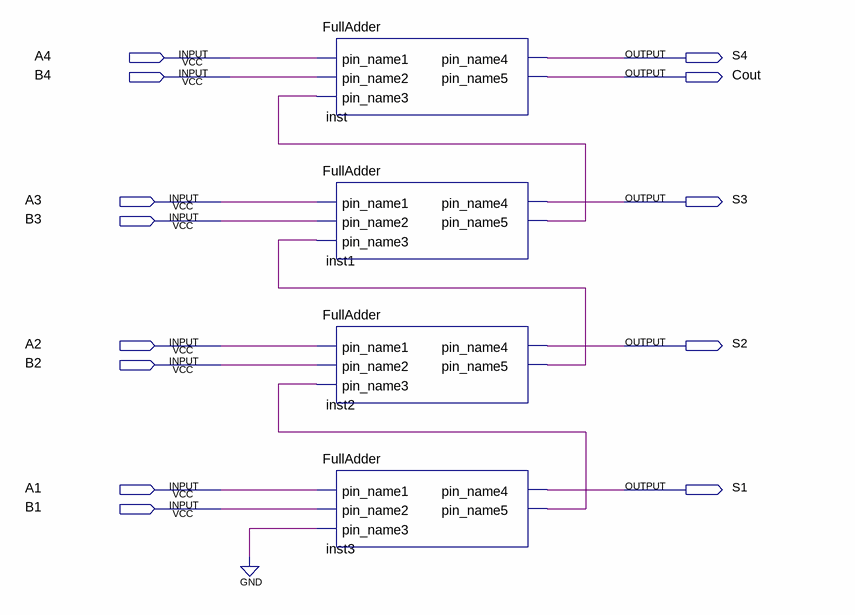
[diagram p0: schematic sheet]
// Quartus schematic Adder4.bdf as structural Verilog: 4 symbols, 13 pins
module Adder4 (
  input  A4,
  input  B4,
  input  A3,
  input  B3,
  input  A2,
  input  B2,
  input  A1,
  input  B1,
  output S4,
  output Cout,
  output S3,
  output S2,
  output S1
);

  wire inst1_pin_name5, inst2_pin_name5, inst3_pin_name5;

  FullAdder inst (.pin_name1(A4), .pin_name2(B4), .pin_name3(inst1_pin_name5), .pin_name4(S4), .pin_name5(Cout));
  FullAdder inst1 (
    .pin_name1(A3), .pin_name2(B3), .pin_name3(inst2_pin_name5), .pin_name4(S3), .pin_name5(inst1_pin_name5));
  FullAdder inst2 (
    .pin_name1(A2), .pin_name2(B2), .pin_name3(inst3_pin_name5), .pin_name4(S2), .pin_name5(inst2_pin_name5));
  FullAdder inst3 (.pin_name1(A1), .pin_name2(B1), .pin_name3(1'b0), .pin_name4(S1), .pin_name5(inst3_pin_name5));
endmodule
